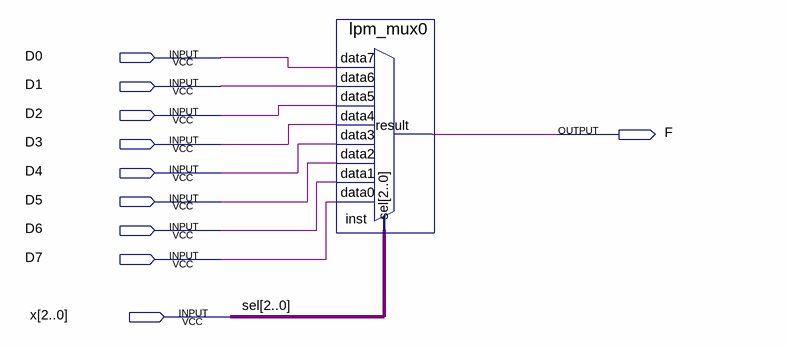
[diagram p0: schematic sheet]
// Quartus schematic mux22.bdf as structural Verilog: 1 symbols, 10 pins
module mux22 (
  input  D0,
  input  D1,
  input  D2,
  input  D3,
  input  D4,
  input  D5,
  input  D6,
  input  D7,
  input  [2:0] x,
  output F
);

  lpm_mux0 inst (
    .data7(D0), .data6(D1), .data5(D2), .data4(D3), .data3(D4), .data2(D5), .data1(D6), .data0(D7), .sel(x),
    .result(F));

  // Other names for the same wires on the sheet: sel[2:0] = x
endmodule
